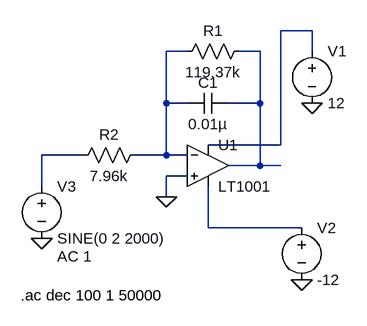
[diagram p0: schematic lab5.asc]
lab5.asc, the LTspice schematic file:
Version 4
SHEET 1 880 680
WIRE 352 -64 304 -64
WIRE 160 -32 128 -32
WIRE 272 -32 240 -32
WIRE 352 -32 352 -64
WIRE 128 48 128 -32
WIRE 160 48 128 48
WIRE 272 48 272 -32
WIRE 272 48 224 48
WIRE 304 112 304 -64
WIRE 304 112 192 112
WIRE 0 128 -64 128
WIRE 128 128 128 48
WIRE 128 128 80 128
WIRE 160 128 128 128
WIRE 272 144 272 48
WIRE 272 144 224 144
WIRE 304 144 272 144
WIRE 160 160 128 160
WIRE -64 176 -64 128
WIRE 128 192 128 160
WIRE 192 240 192 176
WIRE 336 240 192 240
FLAG -64 256 0
FLAG 352 48 0
FLAG 336 320 0
FLAG 128 192 0
SYMBOL Opamps\\LT1001 192 80 R0
SYMATTR InstName U1
SYMBOL cap 224 32 R90
WINDOW 0 0 32 VBottom 2
WINDOW 3 32 32 VTop 2
SYMATTR InstName C1
SYMATTR Value 0.01µ
SYMBOL res 256 -48 R90
WINDOW 0 0 56 VBottom 2
WINDOW 3 32 56 VTop 2
SYMATTR InstName R1
SYMATTR Value 119.37k
SYMBOL res 96 112 R90
WINDOW 0 0 56 VBottom 2
WINDOW 3 32 56 VTop 2
SYMATTR InstName R2
SYMATTR Value 7.96k
SYMBOL voltage 352 -48 R0
WINDOW 123 0 0 Left 0
WINDOW 39 0 0 Left 0
SYMATTR InstName V1
SYMATTR Value 12
SYMBOL voltage 336 224 R0
WINDOW 123 0 0 Left 0
WINDOW 39 0 0 Left 0
SYMATTR InstName V2
SYMATTR Value -12
SYMBOL voltage -64 160 R0
WINDOW 123 24 124 Left 2
WINDOW 39 0 0 Left 0
SYMATTR Value2 AC 1
SYMATTR InstName V3
SYMATTR Value SINE(0 2 2000)
TEXT -96 344 Left 2 !.ac dec 100 1 50000

The netlist it stands for:
* lab5.asc
XU1 0 N002 N001 N005 N003 LT1001  ; pins In+ In- V+ V- OUT
C1 N003 N002 0.01µ
R1 N003 N002 119.37k
R2 N002 N004 7.96k
V1 N001 0 12
V2 N005 0 -12
V3 N004 0 SINE(0 2 2000) AC 1
.ac dec 100 1 50000
.lib LTC.lib
.backanno
.end